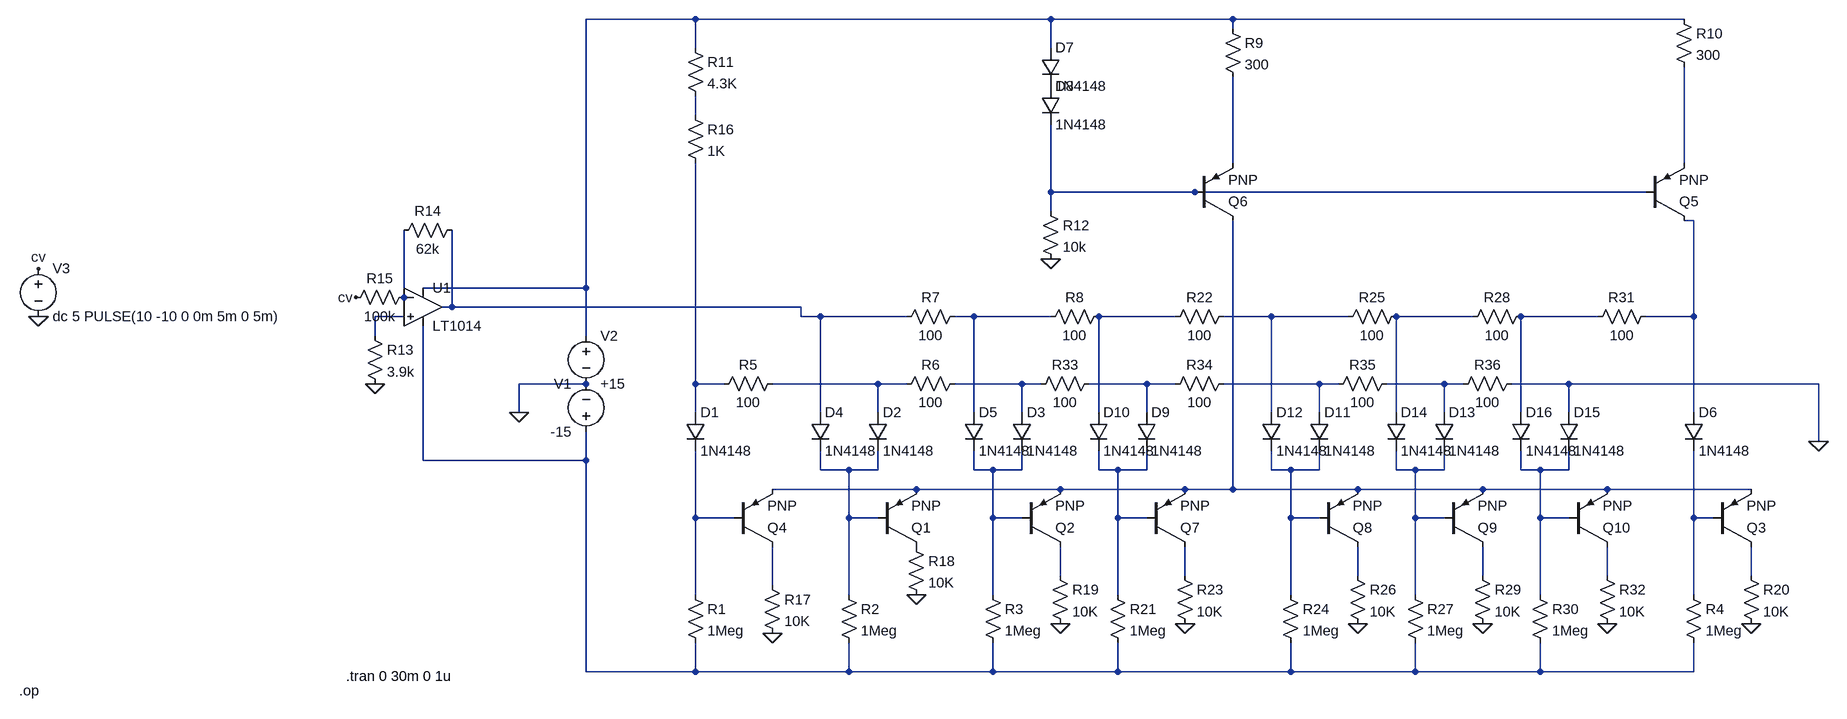
[diagram p0: schematic scanner1.asc]
scanner1.asc, the LTspice schematic file:
Version 4
SHEET 1 1780 680
WIRE -272 -688 -576 -688
WIRE 320 -688 -272 -688
WIRE 624 -688 320 -688
WIRE 1376 -688 624 -688
WIRE 624 -672 624 -688
WIRE -272 -640 -272 -688
WIRE 320 -640 320 -688
WIRE -272 -528 -272 -560
WIRE 624 -448 624 -592
WIRE 1376 -448 1376 -608
WIRE 320 -400 320 -512
WIRE 560 -400 320 -400
WIRE 1312 -400 560 -400
WIRE 320 -368 320 -400
WIRE 1392 -352 1376 -352
WIRE -576 -240 -576 -688
WIRE -576 -240 -848 -240
WIRE -880 -224 -880 -336
WIRE -800 -208 -800 -336
WIRE -800 -208 -816 -208
WIRE -96 -208 -800 -208
WIRE -880 -192 -928 -192
WIRE -96 -192 -96 -208
WIRE -64 -192 -96 -192
WIRE 80 -192 -64 -192
WIRE 192 -192 160 -192
WIRE 320 -192 192 -192
WIRE 528 -192 400 -192
WIRE 688 -192 608 -192
WIRE 816 -192 688 -192
WIRE 1024 -192 896 -192
WIRE 1232 -192 1104 -192
WIRE 1392 -192 1392 -352
WIRE 1392 -192 1312 -192
WIRE -928 -160 -928 -192
WIRE -576 -160 -576 -240
WIRE -576 -80 -688 -80
WIRE -272 -80 -272 -448
WIRE -224 -80 -272 -80
WIRE 32 -80 -144 -80
WIRE 80 -80 32 -80
WIRE 272 -80 160 -80
WIRE 304 -80 272 -80
WIRE 480 -80 384 -80
WIRE 528 -80 480 -80
WIRE 768 -80 608 -80
WIRE 800 -80 768 -80
WIRE 976 -80 880 -80
WIRE 1008 -80 976 -80
WIRE 1184 -80 1088 -80
WIRE 1600 -80 1184 -80
WIRE -688 -32 -688 -80
WIRE -272 -32 -272 -80
WIRE -64 -32 -64 -192
WIRE 32 -32 32 -80
WIRE 192 -32 192 -192
WIRE 272 -32 272 -80
WIRE 400 -32 400 -192
WIRE 480 -32 480 -80
WIRE 688 -32 688 -192
WIRE 768 -32 768 -80
WIRE 896 -32 896 -192
WIRE 976 -32 976 -80
WIRE 1104 -32 1104 -192
WIRE 1184 -32 1184 -80
WIRE 1392 -32 1392 -192
WIRE 1600 16 1600 -80
WIRE -848 48 -848 -176
WIRE -576 48 -576 0
WIRE -576 48 -848 48
WIRE -64 64 -64 32
WIRE -16 64 -64 64
WIRE 32 64 32 32
WIRE 32 64 -16 64
WIRE 192 64 192 32
WIRE 224 64 192 64
WIRE 272 64 272 32
WIRE 272 64 224 64
WIRE 400 64 400 32
WIRE 432 64 400 64
WIRE 480 64 480 32
WIRE 480 64 432 64
WIRE 688 64 688 32
WIRE 720 64 688 64
WIRE 768 64 768 32
WIRE 768 64 720 64
WIRE 896 64 896 32
WIRE 928 64 896 64
WIRE 976 64 976 32
WIRE 976 64 928 64
WIRE 1104 64 1104 32
WIRE 1136 64 1104 64
WIRE 1184 64 1184 32
WIRE 1184 64 1136 64
WIRE 96 96 -144 96
WIRE 336 96 96 96
WIRE 544 96 336 96
WIRE 624 96 624 -352
WIRE 624 96 544 96
WIRE 832 96 624 96
WIRE 1040 96 832 96
WIRE 1248 96 1040 96
WIRE 1488 96 1248 96
WIRE -272 144 -272 32
WIRE -208 144 -272 144
WIRE -16 144 -16 64
WIRE 32 144 -16 144
WIRE 224 144 224 64
WIRE 272 144 224 144
WIRE 432 144 432 64
WIRE 480 144 432 144
WIRE 720 144 720 64
WIRE 768 144 720 144
WIRE 928 144 928 64
WIRE 976 144 928 144
WIRE 1136 144 1136 64
WIRE 1184 144 1136 144
WIRE 1392 144 1392 32
WIRE 1424 144 1392 144
WIRE 336 240 336 192
WIRE 544 240 544 192
WIRE 832 240 832 192
WIRE 1040 240 1040 192
WIRE 1248 240 1248 192
WIRE 1488 240 1488 192
WIRE -144 256 -144 192
WIRE -272 272 -272 144
WIRE -16 272 -16 144
WIRE 224 272 224 144
WIRE 432 272 432 144
WIRE 720 272 720 144
WIRE 928 272 928 144
WIRE 1136 272 1136 144
WIRE 1392 272 1392 144
WIRE -576 400 -576 48
WIRE -272 400 -272 352
WIRE -272 400 -576 400
WIRE -16 400 -16 352
WIRE -16 400 -272 400
WIRE 224 400 224 352
WIRE 224 400 -16 400
WIRE 432 400 432 352
WIRE 432 400 224 400
WIRE 720 400 720 352
WIRE 720 400 432 400
WIRE 928 400 928 352
WIRE 928 400 720 400
WIRE 1136 400 1136 352
WIRE 1136 400 928 400
WIRE 1392 400 1392 352
WIRE 1392 400 1136 400
FLAG 1600 16 0
FLAG -688 -32 0
FLAG -1936 -272 cv
FLAG -1936 -192 0
FLAG 320 -288 0
FLAG -960 -224 cv
FLAG -928 -80 0
FLAG -144 336 0
FLAG 96 272 0
FLAG 336 320 0
FLAG 1488 320 0
FLAG 544 320 0
FLAG 832 320 0
FLAG 1040 320 0
FLAG 1248 320 0
DATAFLAG -320 -208 ""
DATAFLAG 240 -192 ""
DATAFLAG 1344 -192 ""
DATAFLAG 1312 -80 ""
DATAFLAG 224 -80 ""
DATAFLAG -16 -80 ""
DATAFLAG -256 -80 ""
DATAFLAG 448 -192 ""
DATAFLAG 432 -80 ""
DATAFLAG 736 -192 ""
DATAFLAG 720 -80 ""
DATAFLAG 944 -192 ""
DATAFLAG 928 -80 ""
DATAFLAG 1152 -192 ""
DATAFLAG 1136 -80 ""
SYMBOL pnp 32 192 M180
SYMATTR InstName Q1
SYMBOL pnp 272 192 M180
SYMATTR InstName Q2
SYMBOL pnp 1424 192 M180
SYMATTR InstName Q3
SYMBOL pnp -208 192 M180
SYMATTR InstName Q4
SYMBOL diode -288 -32 R0
SYMATTR InstName D1
SYMATTR Value 1N4148
SYMBOL diode 16 -32 R0
SYMATTR InstName D2
SYMATTR Value 1N4148
SYMBOL diode 256 -32 R0
SYMATTR InstName D3
SYMATTR Value 1N4148
SYMBOL diode -80 -32 R0
SYMATTR InstName D4
SYMATTR Value 1N4148
SYMBOL res -288 256 R0
SYMATTR InstName R1
SYMATTR Value 1Meg
SYMBOL res -32 256 R0
SYMATTR InstName R2
SYMATTR Value 1Meg
SYMBOL res 208 256 R0
SYMATTR InstName R3
SYMATTR Value 1Meg
SYMBOL res 1376 256 R0
SYMATTR InstName R4
SYMATTR Value 1Meg
SYMBOL diode 176 -32 R0
SYMATTR InstName D5
SYMATTR Value 1N4148
SYMBOL res -128 -96 R90
WINDOW 0 0 56 VBottom 2
WINDOW 3 32 56 VTop 2
SYMATTR InstName R5
SYMATTR Value 100
SYMBOL res 176 -96 R90
WINDOW 0 0 56 VBottom 2
WINDOW 3 32 56 VTop 2
SYMATTR InstName R6
SYMATTR Value 100
SYMBOL diode 1376 -32 R0
SYMATTR InstName D6
SYMATTR Value 1N4148
SYMBOL res 176 -208 R90
WINDOW 0 0 56 VBottom 2
WINDOW 3 32 56 VTop 2
SYMATTR InstName R7
SYMATTR Value 100
SYMBOL res 416 -208 R90
WINDOW 0 0 56 VBottom 2
WINDOW 3 32 56 VTop 2
SYMATTR InstName R8
SYMATTR Value 100
SYMBOL pnp 1312 -352 M180
SYMATTR InstName Q5
SYMBOL pnp 560 -352 M180
SYMATTR InstName Q6
SYMBOL res 608 -688 R0
SYMATTR InstName R9
SYMATTR Value 300
SYMBOL res 1360 -704 R0
SYMATTR InstName R10
SYMATTR Value 300
SYMBOL voltage -576 -176 R0
WINDOW 123 0 0 Left 0
WINDOW 39 0 0 Left 0
SYMATTR InstName V2
SYMATTR Value +15
SYMBOL voltage -576 16 R180
WINDOW 0 24 96 Left 2
WINDOW 3 24 16 Left 2
WINDOW 123 0 0 Left 0
WINDOW 39 0 0 Left 0
SYMATTR InstName V1
SYMATTR Value -15
SYMBOL voltage -1936 -288 R0
WINDOW 123 0 0 Left 0
WINDOW 39 0 0 Left 0
SYMATTR InstName V3
SYMATTR Value dc 5 PULSE(10 -10 0 0m 5m 0 5m)
SYMBOL diode 304 -640 R0
SYMATTR InstName D7
SYMATTR Value 1N4148
SYMBOL diode 304 -576 R0
SYMATTR InstName D8
SYMATTR Value 1N4148
SYMBOL res 304 -384 R0
SYMATTR InstName R12
SYMATTR Value 10k
SYMBOL res -288 -656 R0
SYMATTR InstName R11
SYMATTR Value 4.3K
SYMBOL OpAmps\\LT1014 -848 -272 R0
SYMATTR InstName U1
SYMBOL res -944 -176 R0
SYMATTR InstName R13
SYMATTR Value 3.9k
SYMBOL res -784 -352 R90
WINDOW 0 0 56 VBottom 2
WINDOW 3 32 56 VTop 2
SYMATTR InstName R14
SYMATTR Value 62k
SYMBOL res -864 -240 R90
WINDOW 0 0 56 VBottom 2
WINDOW 3 32 56 VTop 2
SYMATTR InstName R15
SYMATTR Value 100k
SYMBOL res -288 -544 R0
SYMATTR InstName R16
SYMATTR Value 1K
SYMBOL res -160 240 R0
SYMATTR InstName R17
SYMATTR Value 10K
SYMBOL res 80 176 R0
SYMATTR InstName R18
SYMATTR Value 10K
SYMBOL res 320 224 R0
SYMATTR InstName R19
SYMATTR Value 10K
SYMBOL res 1472 224 R0
SYMATTR InstName R20
SYMATTR Value 10K
SYMBOL pnp 480 192 M180
SYMATTR InstName Q7
SYMBOL diode 464 -32 R0
SYMATTR InstName D9
SYMATTR Value 1N4148
SYMBOL res 416 256 R0
SYMATTR InstName R21
SYMATTR Value 1Meg
SYMBOL diode 384 -32 R0
SYMATTR InstName D10
SYMATTR Value 1N4148
SYMBOL res 624 -208 R90
WINDOW 0 0 56 VBottom 2
WINDOW 3 32 56 VTop 2
SYMATTR InstName R22
SYMATTR Value 100
SYMBOL res 528 224 R0
SYMATTR InstName R23
SYMATTR Value 10K
SYMBOL pnp 768 192 M180
SYMATTR InstName Q8
SYMBOL diode 752 -32 R0
SYMATTR InstName D11
SYMATTR Value 1N4148
SYMBOL res 704 256 R0
SYMATTR InstName R24
SYMATTR Value 1Meg
SYMBOL diode 672 -32 R0
SYMATTR InstName D12
SYMATTR Value 1N4148
SYMBOL res 912 -208 R90
WINDOW 0 0 56 VBottom 2
WINDOW 3 32 56 VTop 2
SYMATTR InstName R25
SYMATTR Value 100
SYMBOL res 816 224 R0
SYMATTR InstName R26
SYMATTR Value 10K
SYMBOL pnp 976 192 M180
SYMATTR InstName Q9
SYMBOL diode 960 -32 R0
SYMATTR InstName D13
SYMATTR Value 1N4148
SYMBOL res 912 256 R0
SYMATTR InstName R27
SYMATTR Value 1Meg
SYMBOL diode 880 -32 R0
SYMATTR InstName D14
SYMATTR Value 1N4148
SYMBOL res 1120 -208 R90
WINDOW 0 0 56 VBottom 2
WINDOW 3 32 56 VTop 2
SYMATTR InstName R28
SYMATTR Value 100
SYMBOL res 1024 224 R0
SYMATTR InstName R29
SYMATTR Value 10K
SYMBOL pnp 1184 192 M180
SYMATTR InstName Q10
SYMBOL diode 1168 -32 R0
SYMATTR InstName D15
SYMATTR Value 1N4148
SYMBOL res 1120 256 R0
SYMATTR InstName R30
SYMATTR Value 1Meg
SYMBOL diode 1088 -32 R0
SYMATTR InstName D16
SYMATTR Value 1N4148
SYMBOL res 1328 -208 R90
WINDOW 0 0 56 VBottom 2
WINDOW 3 32 56 VTop 2
SYMATTR InstName R31
SYMATTR Value 100
SYMBOL res 1232 224 R0
SYMATTR InstName R32
SYMATTR Value 10K
SYMBOL res 400 -96 R90
WINDOW 0 0 56 VBottom 2
WINDOW 3 32 56 VTop 2
SYMATTR InstName R33
SYMATTR Value 100
SYMBOL res 624 -96 R90
WINDOW 0 0 56 VBottom 2
WINDOW 3 32 56 VTop 2
SYMATTR InstName R34
SYMATTR Value 100
SYMBOL res 896 -96 R90
WINDOW 0 0 56 VBottom 2
WINDOW 3 32 56 VTop 2
SYMATTR InstName R35
SYMATTR Value 100
SYMBOL res 1104 -96 R90
WINDOW 0 0 56 VBottom 2
WINDOW 3 32 56 VTop 2
SYMATTR InstName R36
SYMATTR Value 100
TEXT -976 408 Left 2 !.tran 0 30m 0 1u
TEXT -1968 432 Left 2 !.op

The netlist it stands for:
* scanner1.asc
Q1 P001 N022 N028 0 PNP
Q2 N031 N023 N028 0 PNP
Q3 N036 N030 N028 0 PNP
Q4 N037 N029 N028 0 PNP
D1 N015 N029 1N4148
D2 N016 N022 1N4148
D3 N017 N023 1N4148
D4 N008 N022 1N4148
R1 N029 N021 1Meg
R2 N022 N021 1Meg
R3 N023 N021 1Meg
R4 N030 N021 1Meg
D5 N010 N023 1N4148
R5 N016 N015 100
R6 N017 N016 100
D6 N006 N030 1N4148
R7 N010 N008 100
R8 N011 N010 100
Q5 N006 N005 N004 0 PNP
Q6 N028 N005 N003 0 PNP
R9 N001 N003 300
R10 N001 N004 300
V2 N001 0 +15
V1 N021 0 -15
V3 cv 0 dc 5 PULSE(10 -10 0 0m 5m 0 5m)
D7 N001 P002 1N4148
D8 P002 N005 1N4148
R12 N005 0 10k
R11 N001 N002 4.3K
XU1 N009 N007 N001 N021 N008 LT1014  ; pins In+ In- V+ V- OUT
R13 N009 0 3.9k
R14 N008 N007 62k
R15 N007 cv 100k
R16 N002 N015 1K
R17 N037 0 10K
R18 P001 0 10K
R19 N031 0 10K
R20 N036 0 10K
Q7 N032 N024 N028 0 PNP
D9 N018 N024 1N4148
R21 N024 N021 1Meg
D10 N011 N024 1N4148
R22 N012 N011 100
R23 N032 0 10K
Q8 N033 N025 N028 0 PNP
D11 N019 N025 1N4148
R24 N025 N021 1Meg
D12 N012 N025 1N4148
R25 N013 N012 100
R26 N033 0 10K
Q9 N034 N026 N028 0 PNP
D13 N020 N026 1N4148
R27 N026 N021 1Meg
D14 N013 N026 1N4148
R28 N014 N013 100
R29 N034 0 10K
Q10 N035 N027 N028 0 PNP
D15 0 N027 1N4148
R30 N027 N021 1Meg
D16 N014 N027 1N4148
R31 N006 N014 100
R32 N035 0 10K
R33 N018 N017 100
R34 N019 N018 100
R35 N020 N019 100
R36 0 N020 100
.model D D
.lib standard.dio
.model NPN NPN
.model PNP PNP
.lib standard.bjt
.tran 0 30m 0 1u
.op
.backanno
.end